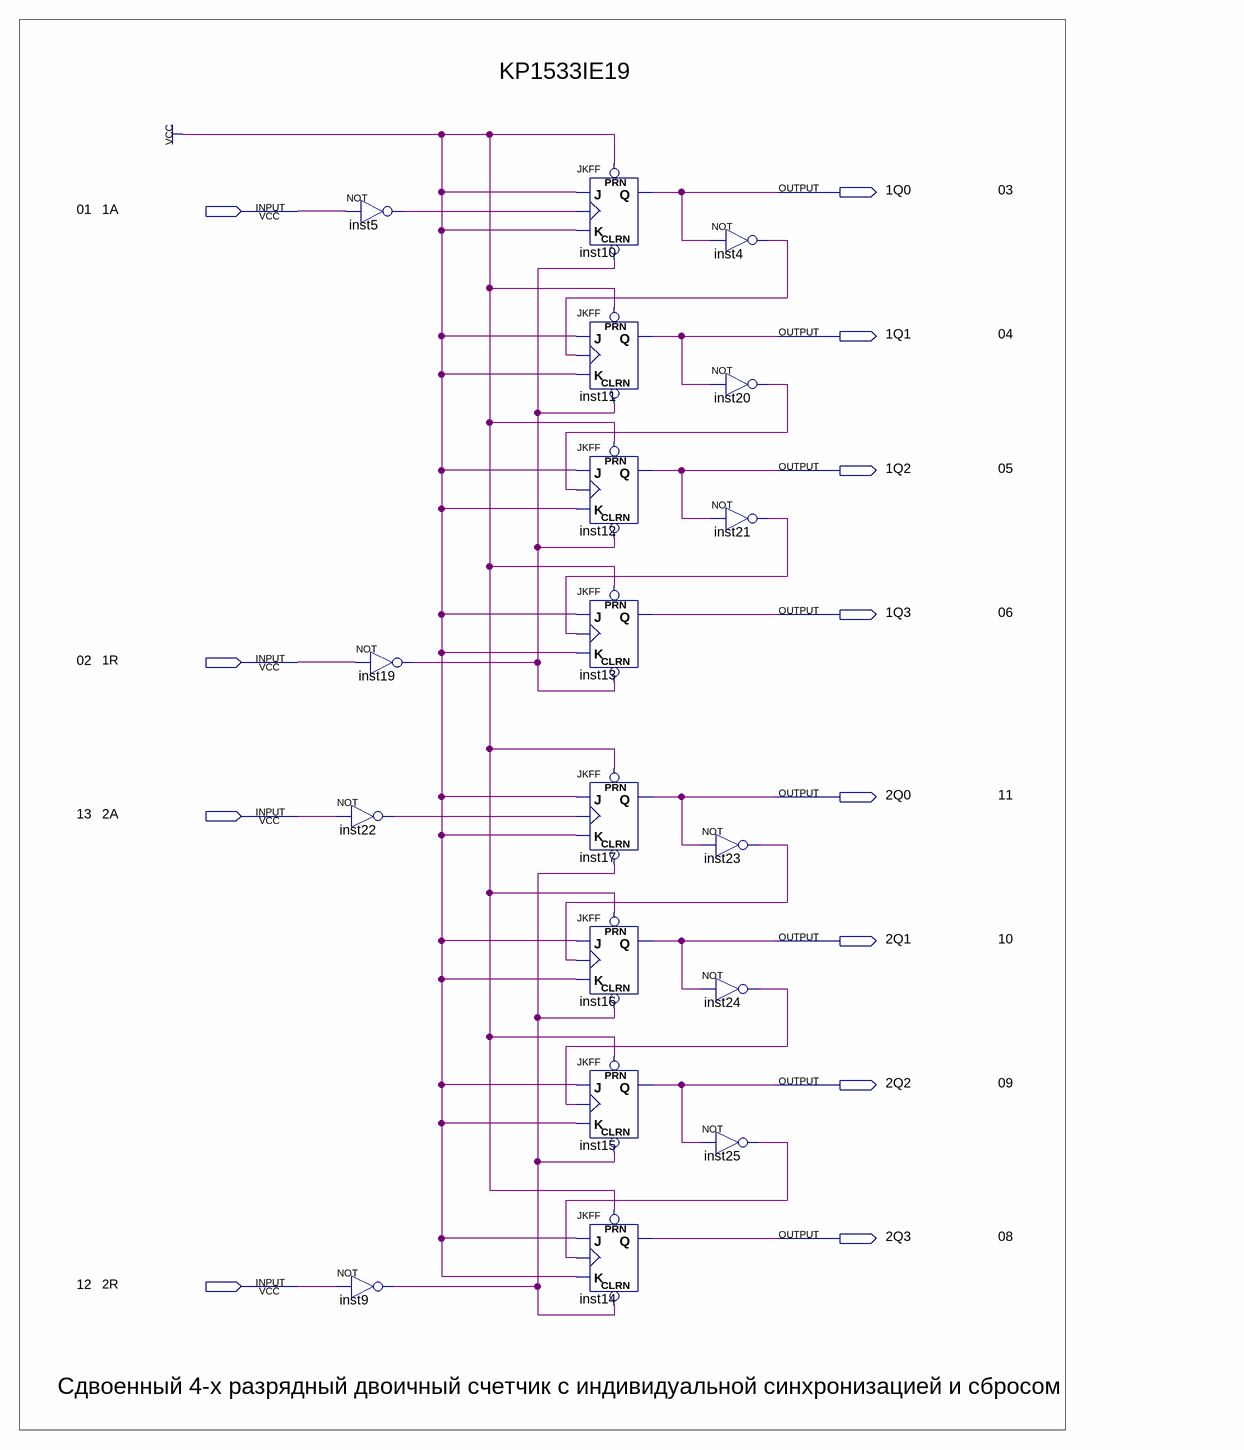
[diagram p0: schematic sheet]
// Quartus schematic KP1533IE19.bdf as structural Verilog: 18 symbols, 12 pins
module KP1533IE19 (
  input  \1A ,
  input  \1R ,
  input  \2A ,
  input  \2R ,
  output \1Q0 ,
  output \1Q1 ,
  output \1Q2 ,
  output \1Q3 ,
  output \2Q0 ,
  output \2Q1 ,
  output \2Q2 ,
  output \2Q3 
);

  wire inst4_out, inst5_out, inst9_out, inst19_out, inst20_out, inst21_out, inst22_out, inst23_out,
       inst24_out, inst25_out;

  not inst5 (inst5_out, \1A );
  not inst19 (inst19_out, \1R );
  not inst22 (inst22_out, \2A );
  not inst9 (inst9_out, \2R );
  JKFF inst10 (.PRN(1'b1), .CLRN(inst19_out), .K(1'b1), .J(1'b1), .CLK(inst5_out), .Q(\1Q0 ));
  JKFF inst11 (.PRN(1'b1), .CLRN(inst19_out), .K(1'b1), .J(1'b1), .CLK(inst4_out), .Q(\1Q1 ));
  JKFF inst12 (.PRN(1'b1), .CLRN(inst19_out), .K(1'b1), .J(1'b1), .CLK(inst20_out), .Q(\1Q2 ));
  JKFF inst13 (.PRN(1'b1), .CLRN(inst19_out), .K(1'b1), .J(1'b1), .CLK(inst21_out), .Q(\1Q3 ));
  JKFF inst17 (.PRN(1'b1), .CLRN(inst9_out), .K(1'b1), .J(1'b1), .CLK(inst22_out), .Q(\2Q0 ));
  JKFF inst16 (.PRN(1'b1), .CLRN(inst9_out), .K(1'b1), .J(1'b1), .CLK(inst23_out), .Q(\2Q1 ));
  JKFF inst15 (.PRN(1'b1), .CLRN(inst9_out), .K(1'b1), .J(1'b1), .CLK(inst24_out), .Q(\2Q2 ));
  JKFF inst14 (.PRN(1'b1), .CLRN(inst9_out), .K(1'b1), .J(1'b1), .CLK(inst25_out), .Q(\2Q3 ));
  not inst23 (inst23_out, \2Q0 );
  not inst24 (inst24_out, \2Q1 );
  not inst25 (inst25_out, \2Q2 );
  not inst4 (inst4_out, \1Q0 );
  not inst20 (inst20_out, \1Q1 );
  not inst21 (inst21_out, \1Q2 );

  // Notes on the sheet:
  //   KP1533IE19
  //   03
  //   01
  //   04
  //   05
  //   06
  //   02
  //   11
  //   13
  //   10
  //   09
  //   08
  //   12
  //   Сдвоенный 4-х разрядный двоичный счетчик с индивидуальной синхронизацией и сбросом
endmodule
